# Altium schematic sheet Display.SchDoc
size A4; Revision: 0
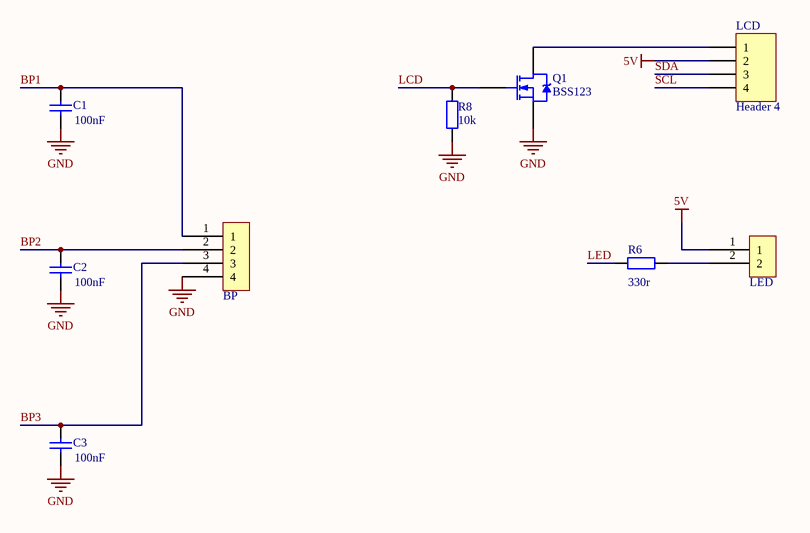
[diagram p0: Display.SchDoc]

## Parts
BP  Bornier_4_vis  [282834-4]  (value not drawn)
C1  100nF  [0805-C]
C2  100nF  [0805-C]
C3  100nF  [0805-C]
LCD  Header 4  [HDR1X4]
LED  Bornier_2_vis  [282834-2]  (value not drawn)
Q1  BSS123  [SOT23-3]
R6  330r  [0805-R]
R8  10k  [0805-R]

## Nets
5V: LCD.2 LED.1
GND: BP.4 C1.1 C2.1 C3.1 Q1.2(S) R8.1
BP1: BP.1 C1.2
BP2: BP.2 C2.2
BP3: BP.3 C3.2
LCD: Q1.1(G) R8.2
LED: R6.1
SCL: LCD.4
SDA: LCD.3
NetLCD_1: LCD.1 Q1.3(D)
NetLED_2: LED.2 R6.2

## Notes on the sheet
- Title
- Size:
- Date:
- A4
- Number:
- Time:
- Revision:
- Sheet
- of
- File:

## Library data of the parts
BP = Bornier_4_vis: Bornier fil-à-carte, 2.54 mm, 4 Voies, 30 AWG, 16 AWG, 1.4 mm², Par vis; Fabricant: TE; Fournisseur: Farnell; RefFournisseur: 2396253; Valeur: 10A - 4voies; Voltage: 150V; RefFabricant: 282834-4
C1-C3 = Cap_np: Condensateur céramique multicouche CMS, 0.1 µF, 50 V, 0805 [2012 Metric], ± 10%, X7R; Fabricant: AVX; Fournisseur: Farnell; RefFabricant: 08055C104KAT2A; RefFournisseur: 499687; Voltage: 50V; Revision: July-2002: Re-released for DXP Platform.; Valeur: 100nF
LCD = Header 4: Header mâle, Carte-à-carte, 2.54 mm, 1 Rangée(s), 10 Contact(s), Traversant, droit, Série 2211S; Fabricant: MULTICOMP PRO; Fournisseur: Farnell; RefFabricant: 2211S-10G; RefFournisseur: 1593417; Valeur: 10 cts
LED = Bornier_2_vis: Bornier fil-à-carte, 2.54 mm, 2 Voies, 30 AWG, 16 AWG, 1.4 mm², Par vis; Fabricant: TE; Fournisseur: Farnell; RefFournisseur: 2112482; Valeur: 10A - 2voies; Voltage: 150V; RefFabricant: 282834-2
Q1 = 2N7000: MOSFET de puissance, Canal N, 100 V, 170 mA, 1.2 ohm, SOT-23, Montage en surface; Fabricant: ON SEMICONDUCTOR; Fournisseur: Farnell; RefFournisseur: 9845321; Voltage: 100V; RefFabricant: BSS123
R6 = Res: Résistance à puce CMS, Couche épaisse, 330 ohm, ± 1%, 125 mW, 0805 [2012 Metric], Couche épaisse; Fabricant: MULTICOMP PRO; Fournisseur: Farnell; RefFabricant: MCWR08X3300FTL; RefFournisseur: 2447638; Voltage: 150V; Revision: July-2002: Re-released for DXP Platform.; Valeur: 330r
R8 = Res: Résistance à puce CMS, 10 kohm, ± 1%, 250 mW, 0805 [2012 Metric], Couche épaisse, Haute puissance; Fabricant: MULTICOMP PRO; Fournisseur: Farnell; RefFabricant: MCWF08P1002FTL; RefFournisseur: 2694096; Voltage: 150V; Valeur: 10k